# EAGLE schematic hw2 (EAGLE 8.7.1)
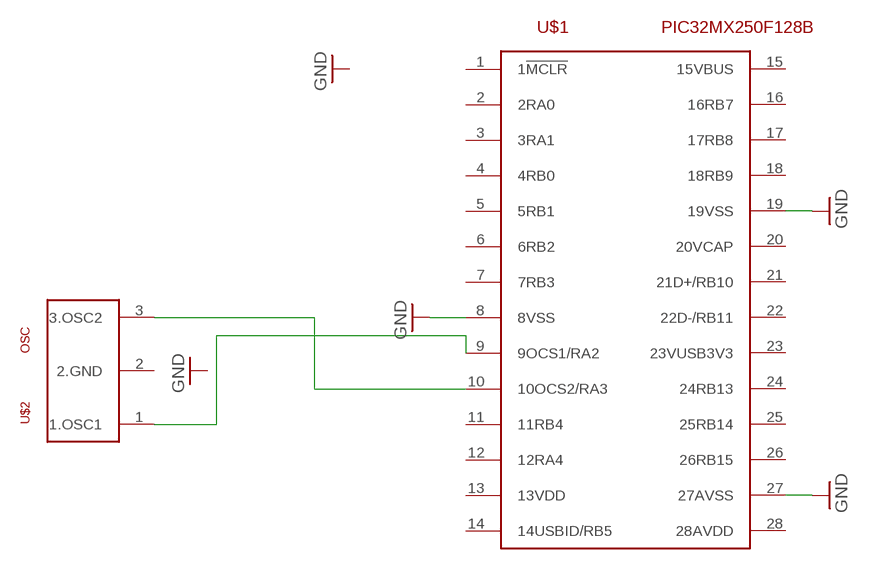
[diagram p0: schematic, sheet 1]

## Parts
U$1  PIC32MX250F128B  [DIL28-3]
U$2  OSC  [OSC]

## Nets
GND: U$1.8(8VSS) U$1.19(19VSS) U$1.27(27AVSS)
N$1: U$1.10(10OCS2/RA3) U$2.3(3.OSC2)
N$2: U$1.9(9OCS1/RA2) U$2.1(1.OSC1)
Unconnected: U$1.1(1!MCLR) U$1.2(2RA0) U$1.3(3RA1) U$1.4(4RB0) U$1.5(5RB1) U$1.6(6RB2) U$1.7(7RB3) U$1.11(11RB4) U$1.12(12RA4) U$1.13(13VDD) U$1.14(14USBID/RB5) U$1.15(15VBUS) U$1.16(16RB7) U$1.17(17RB8) U$1.18(18RB9) U$1.20(20VCAP) U$1.21(21D+/RB10) U$1.22(22D-/RB11) U$1.23(23VUSB3V3) U$1.24(24RB13) U$1.25(25RB14) U$1.26(26RB15) U$1.28(28AVDD) U$2.2(2.GND)

## Library data of the parts
U$1 = hw2:PIC32MX250F128B
U$2 = hw2:OSC